# Altium project jetson-tx-camera-adapter.PrjPcb
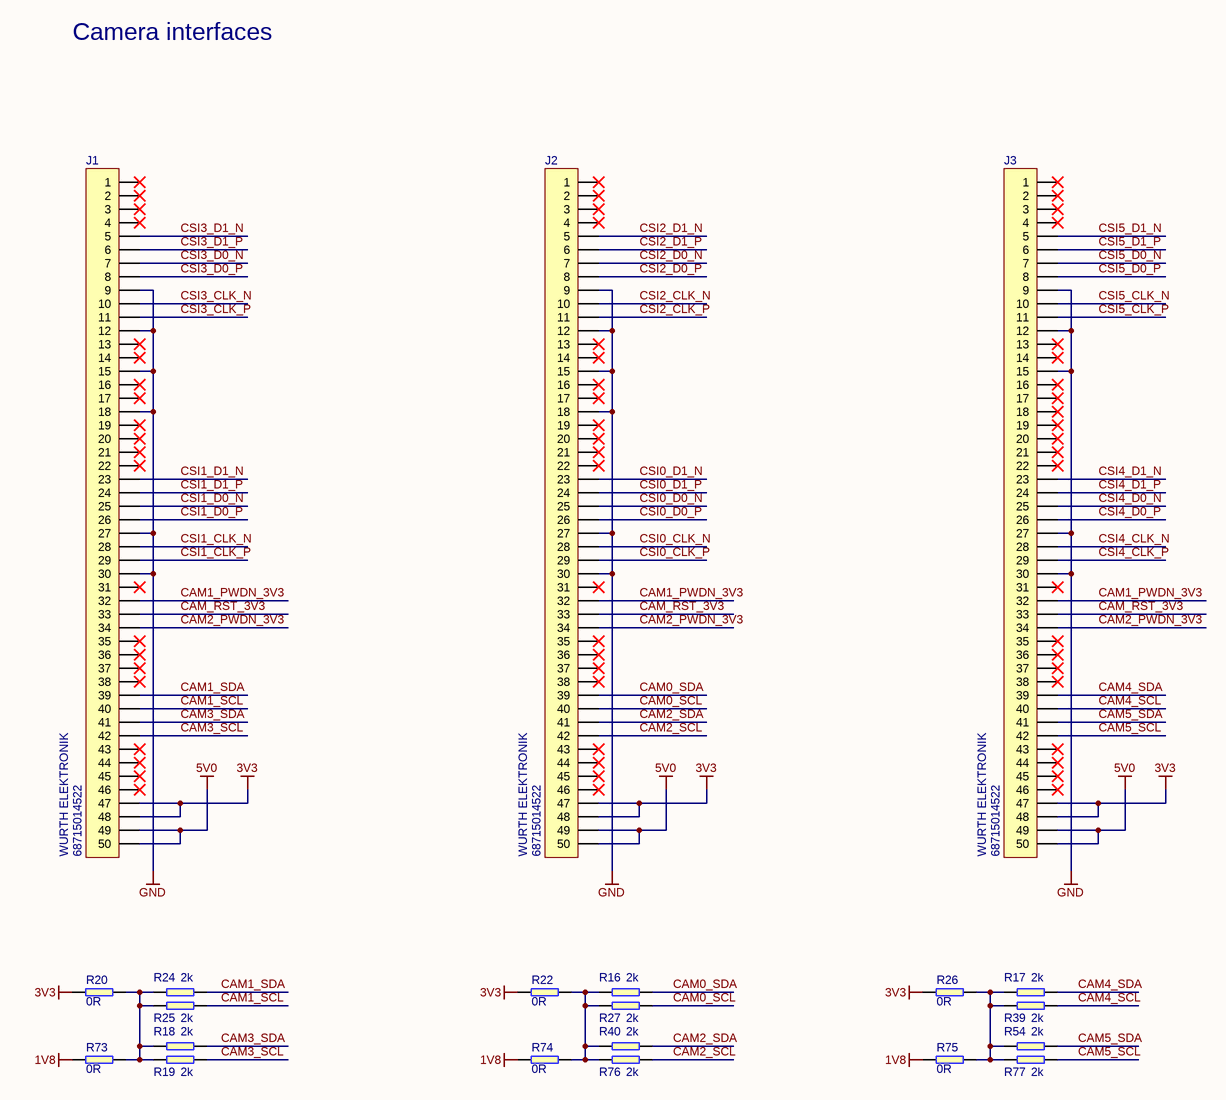
[diagram p0: Cameras.SchDoc]
AM_Title: Jetson TX Camera Adapter; AM_Status: OSHW; AM_Revision: 1.6.1
4 sheets, 113 parts. Net scope: global (net labels, ports and power ports of the same name join across sheets).
Board file: PCB.PcbDoc
Sheets:
  Cameras.SchDoc
  CAN.SchDoc
  ID-Serial.SchDoc
  Interface.SchDoc

## Sheet Cameras.SchDoc: =AM_Title
size A3; CompanyName: Antmicro Ltd; Address1: Zwierzyniecka 3; Address2: 60-813 Poznań; Address3: Poland; Address4: 60-813 Poznań, Poland; Revision: 1.6.1; SheetNumber: 1; SheetTotal: 1; PageSetup: Record=PageOptions|CenterHorizontal=True|CenterVertical=True|PrintScale=0.97|XCorrection=1.00|YCorrection=1.00|PrintKind=1|BorderSize=5000000|LeftOffset=0|BottomOffset=0|Orientation=2|PaperLength=2970|PaperWidth=2100|Scale=100|PaperSource=7|PrintQuality=600|MediaType=1|DitherType=10|PaperKind=A4|PrintScaleMode=1

### Parts
J1  68715014522  Manufacturer: WURTH ELEKTRONIK  [68715014522_FLIPPED]
J2  68715014522  Manufacturer: WURTH ELEKTRONIK  [68715014522_FLIPPED]
J3  68715014522  Manufacturer: WURTH ELEKTRONIK  [68715014522_FLIPPED]
R16  2k  [0603]
R17  2k  [0603]
R18  2k  [0603]
R19  2k  [0603]
R20  0R  [0603]
R22  0R  [0603]
R24  2k  [0603]
R25  2k  [0603]
R26  0R  [0603]
R27  2k  [0603]
R39  2k  [0603]
R40  2k  [0603]
R54  2k  [0603]
R73  0R  [0603]
R74  0R  [0603]
R75  0R  [0603]
R76  2k  [0603]
R77  2k  [0603]

### Nets
1V8: R73.1 R74.1 R75.1
3V3: J1.47 J1.48 J2.47 J2.48 J3.47 J3.48 R20.1 R22.1 R26.1
5V0: J1.49 J1.50 J2.49 J2.50 J3.49 J3.50
GND: J1.9 J1.12 J1.15 J1.18 J1.27 J1.30 J2.9 J2.12 J2.15 J2.18 J2.27 J2.30 J3.9 J3.12 J3.15 J3.27 J3.30
CAM0_SCL: J2.40 R27.1
CAM0_SDA: J2.39 R16.1
CAM1_PWDN_3V3: J1.32 J2.32 J3.32
CAM1_SCL: J1.40 R25.1
CAM1_SDA: J1.39 R24.1
CAM2_PWDN_3V3: J1.34 J2.34 J3.34
CAM2_SCL: J2.42 R76.1
CAM2_SDA: J2.41 R40.1
CAM3_SCL: J1.42 R19.1
CAM3_SDA: J1.41 R18.1
CAM4_SCL: J3.40 R39.1
CAM4_SDA: J3.39 R17.1
CAM5_SCL: J3.42 R77.1
CAM5_SDA: J3.41 R54.1
CAM_RST_3V3: J1.33 J2.33 J3.33
CSI0_CLK_N: J2.28
CSI0_CLK_P: J2.29
CSI0_D0_N: J2.25
CSI0_D0_P: J2.26
CSI0_D1_N: J2.23
CSI0_D1_P: J2.24
CSI1_CLK_N: J1.28
CSI1_CLK_P: J1.29
CSI1_D0_N: J1.25
CSI1_D0_P: J1.26
CSI1_D1_N: J1.23
CSI1_D1_P: J1.24
CSI2_CLK_N: J2.10
CSI2_CLK_P: J2.11
CSI2_D0_N: J2.7
CSI2_D0_P: J2.8
CSI2_D1_N: J2.5
CSI2_D1_P: J2.6
CSI3_CLK_N: J1.10
CSI3_CLK_P: J1.11
CSI3_D0_N: J1.7
CSI3_D0_P: J1.8
CSI3_D1_N: J1.5
CSI3_D1_P: J1.6
CSI4_CLK_N: J3.28
CSI4_CLK_P: J3.29
CSI4_D0_N: J3.25
CSI4_D0_P: J3.26
CSI4_D1_N: J3.23
CSI4_D1_P: J3.24
CSI5_CLK_N: J3.10
CSI5_CLK_P: J3.11
CSI5_D0_N: J3.7
CSI5_D0_P: J3.8
CSI5_D1_N: J3.5
CSI5_D1_P: J3.6
NetR16_2: R16.2 R22.2 R27.2 R40.2 R74.2 R76.2
NetR17_2: R17.2 R26.2 R39.2 R54.2 R75.2 R77.2
NetR18_2: R18.2 R19.2 R20.2 R24.2 R25.2 R73.2

Not connected (* = marked no-connect by the designer): J1 1* 2* 3* 4* 13* 14* 16* 17* 19* 20* 21* 22* 31* 35* 36* 37* 38* 43* 44* 45* 46*; J2 1* 2* 3* 4* 13* 14* 16* 17* 19* 20* 21* 22* 31* 35* 36* 37* 38* 43* 44* 45* 46*; J3 1* 2* 3* 4* 13* 14* 16* 17* 18* 19* 20* 21* 22* 31* 35* 36* 37* 38* 43* 44* 45* 46*

### Notes on the sheet
- Camera interfaces
- Title:
- Drawn by:
- Size:
- Date:
- Approved by:
- A3
- Revision:
- Page:
- of
- www.antmicro.com
- File:

### Library data of the parts
J1-J3 = WE-687-150-145-22_FLIPPED: 0.50mm SMT ZIF Horizontal Bottom Contact WR-FPC; Part Number: WE-687-150-145-22_FLIPPED; Supplier Part Number 1: 1908481; Value: 68715014522; Supplier 1: Farnell; Part Symbol: 68715014522
R16-R19 R24 R25 R27 R39 R40 R54 R76 R77 = R_2k_0603: SMT Resistor 2k 0603; Manufacturer: MULTICOMP; Part Symbol: MCMR06X2001FTL; Value: 2k; Part Number: R_2k_0603; Supplier 1: Farnell; Supplier Part Number 1: 2073418
R20 R22 R26 R73-R75 = R_0R_0603: SMT Resistor 0R 0603; Manufacturer: BOURNS; Part Symbol: CR0603-J/-000ELF; Tolerance: 5%; Part Number: R_0R_0603; Value: 0R; Supplier 1: Farnell; Supplier Part Number 1: 2008343

## Sheet CAN.SchDoc: =AM_Title
size A3; CompanyName: Antmicro Ltd; Address1: Zwierzyniecka 3; Address2: 60-813 Poznań; Address3: Poland; Address4: 60-813 Poznań, Poland; Revision: 1.6.1; SheetNumber: 1; SheetTotal: 1; PageSetup: Record=PageOptions|CenterHorizontal=True|CenterVertical=True|PrintScale=0.97|XCorrection=1.00|YCorrection=1.00|PrintKind=1|BorderSize=5000000|LeftOffset=0|BottomOffset=0|Orientation=2|PaperLength=2970|PaperWidth=2100|Scale=100|PaperSource=7|PrintQuality=600|MediaType=1|DitherType=10|PaperKind=A4|PrintScaleMode=1
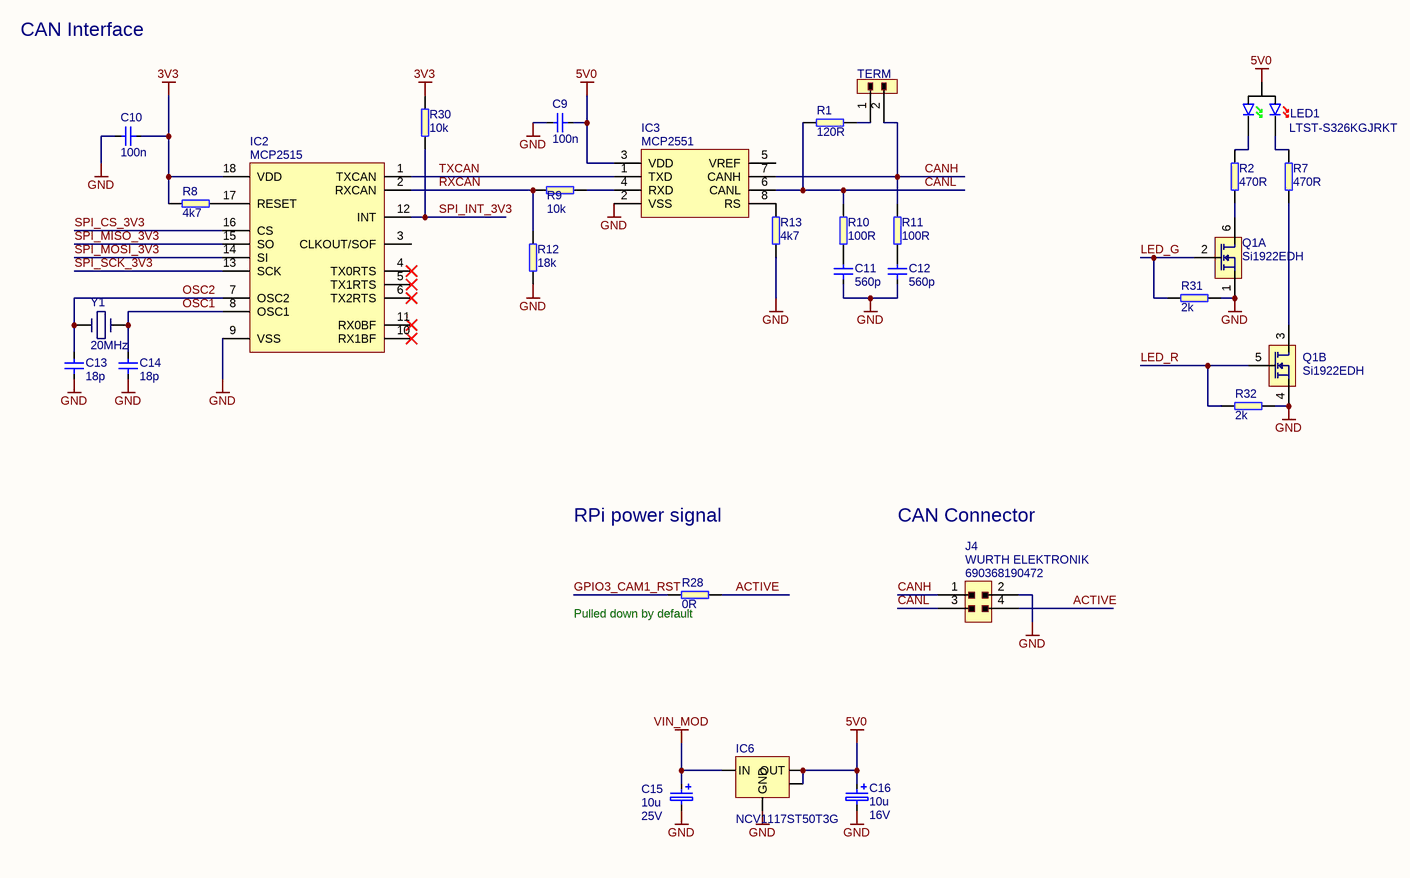
[diagram p1: CAN.SchDoc]

### Parts
C9  100n  [0402]
C10  100n  [0402]
C11  560p  [0603]
C12  560p  [0603]
C13  18p  [0402]
C14  18p  [0402]
C15  value 10u  Voltage: 25V  [KEMET_C]  (hidden comment: CPol)
C16  Voltage: 16V  [KEMET_A]  (hidden comment: 10u)
IC2  MCP2515  [SOIC-18]
IC3  MCP2551  [SOIC-8]
IC6  value NCV1117ST50T3G  [SOT223]  (hidden comment: xx1117)
J4  Manufacturer: WURTH ELEKTRONIK  Part Symbol: 690368190472  [WE_690368190472]  (hidden comment: WE_690368190472)
LED1  Part Symbol: LTST-S326KGJRKT  [LED-LiteON-LTST-S326KGJRKT]  (hidden comment: LED-LiteON-LTST-S326KGJRKT)
Q1  Si1922EDH  [SOT-363]  (parts A,B of 2)
R1  120R  [0603]
R2  470R  [0603]
R7  470R  [0603]
R8  4k7  [0603]
R9  10k  [0603]
R10  100R  [0603]
R11  100R  [0603]
R12  18k  [0603]
R13  4k7  [0603]
R28  0R  [0603]
R30  10k  [0603]
R31  2k  [0603]
R32  2k  [0603]
TERM  HEADER_1X2_male  [HEADER_1X2_male 2.54mm]  (value not drawn)
Y1  20MHz  [TXC_7A]

### Nets
3V3: C10.1 IC2.18(VDD) R8.2 R30.2
5V0: C9.1 C16.1 IC3.3(VDD) IC6.2(OUT) IC6.4(OUT) LED1.A
GND: C9.2 C10.2 C11.1 C12.1 C13.1 C14.1 C15.2 C16.2 IC2.9(VSS) IC3.2(VSS) IC6.1(GND) J4.2 Q1.1(S1) Q1.4(S2) R12.1 R13.1 R31.2 R32.2
VIN_MOD: C15.1 IC6.3(IN)
ACTIVE: J4.4 R28.2
CANH: IC3.7(CANH) J4.1 R11.2 TERM.2
CANL: IC3.6(CANL) J4.3 R1.1 R10.2
GPIO3_CAM1_RST: R28.1
LED_G: Q1.2(G1) R31.1
LED_R: Q1.5(G2) R32.1
OSC1: C14.2 IC2.8(OSC1) Y1.1
OSC2: C13.2 IC2.7(OSC2) Y1.2
RXCAN: IC2.2(RXCAN) R9.1 R12.2
SPI_CS_3V3: IC2.16(CS)
SPI_INT_3V3: IC2.12(INT) R30.1
SPI_MISO_3V3: IC2.15(SO)
SPI_MOSI_3V3: IC2.14(SI)
SPI_SCK_3V3: IC2.13(SCK)
TXCAN: IC2.1(TXCAN) IC3.1(TXD)
NetC11_2: C11.2 R10.1
NetC12_2: C12.2 R11.1
NetIC2_17: IC2.17(RESET) R8.1
NetIC3_4: IC3.4(RXD) R9.2
NetIC3_8: IC3.8(RS) R13.2
NetLED1_C1: LED1.C1 R7.2
NetLED1_C2: LED1.C2 R2.2
NetQ1_3: Q1.3(D2) R7.1
NetQ1_6: Q1.6(D1) R2.1
NetR1_2: R1.2 TERM.1

Not connected (* = marked no-connect by the designer): IC2 3(CLKOUT/SOF) 4(TX0RTS)* 5(TX1RTS)* 6(TX2RTS)* 10(RX1BF)* 11(RX0BF)*; IC3 5(VREF)

### Notes on the sheet
- CAN Interface
- RPi power signal
- CAN Connector
- (near R28) Pulled down by default
- Title:
- Drawn by:
- Size:
- Date:
- Approved by:
- A3
- Revision:
- Page:
- of
- www.antmicro.com
- File:

### Library data of the parts
C9 C10 = C_100n_0402: MLCC SMT Capacitor 100nF 0402; Manufacturer: MULTICOMP; Part Symbol: MC0402X104M100CT; Value: 100n; Part Number: C_100n_0402; Supplier 1: Farnell; Supplier Part Number 1: 2309011
C11 C12 = C_560p_0603: MLCC SMT Capacitor 560pF 0603; Manufacturer: MULTICOMP; Part Symbol: MC0603N561J500CT; Value: 560p; Part Number: C_560p_0603; Supplier 1: Farnell; Supplier Part Number 1: 1759082
C13 C14 = C_18p_0402: MLCC SMT Capacitor 18pF 0603; Manufacturer: KEMET; Part Symbol: C0402C180J5GACAUTO; Value: 18p; Part Number: C_18p_0402; Supplier 1: Farnell; Supplier Part Number 1: 2070379
C15 = C_10u_KEMET_C: Tantalum SMT Capacitor 10uF Case KEMET_C; Manufacturer: KEMET; Part Symbol: T491C106K025AT; Part Number: C_10u_KEMET_C; Supplier 1: Farnell; Supplier Part Number 1: 1457463
C16 = C_10u_KEMET_A: Tantalum SMT Capacitor 10uF Case KEMET_A; Manufacturer: VISHAY; Part Symbol: 293D106X9016A2TE3; Value: 10u; Part Number: C_10u_KEMET_A; Supplier 1: Farnell; Supplier Part Number 1: 1754182
IC2 = MCP2515-I/SO: CAN CONTROLLER, SPI, 1MBPS; Manufacturer: MICROCHIP; Supplier 1: Farnell; Supplier Part Number 1: 1292239; Part Number: MCP2515-I/SO; Value: MCP2515; Part Symbol: MCP2515-I/SO
IC3 = MCP2551-I/SN: MCP2551-I/SN  IC, CAN TRANSCEIVER, HI SPEED, SMD; Manufacturer: MICROCHIP; Supplier 1: Farnell; Supplier Part Number 1: 9758569; Part Number: MCP2551-I/SN; Value: MCP2551; Part Symbol: MCP2551-I/SN
IC6 = xx1117: ON SEMICONDUCTOR  NCV1117ST50T3G  Fixed LDO Voltage Regulator, 20V in, 1.07V Dropout, 5V/1A out, SOT-223-3; Part Number: NCV1117ST50T3G; Supplier 1: Farnell; Supplier Part Number 1: 2534280; Manufacturer: ON SEMICONDUCTOR; Part Symbol: NCV1117ST50T3G
LED1 = LED-LiteON-LTST-S326KGJRKT: Standard LEDs - SMD Green/Red Clear 571nm/631nm; Manufacturer: Lite-On; Part Number: LED-LiteON-LTST-S326KGJRKT; Value: LED-LiteON-LTST-S326KGJRKT; Supplier 1: Mouser; Supplier Part Number 1: 859-LTST-S326KGJRKT
Q1 = Si1922EDH: 20 V, dual N-channel Trench MOSFET; Manufacturer: Vishay; Part Number: Si1922EDH; Value: Si1922EDH; Supplier 1: Farnell; Supplier Part Number 1: 2056714; Part Symbol: Si1922EDH
R1 = R_120R_0603: SMT Resistor 120R 0603; Manufacturer: VISHAY; Part Symbol: CRCW0603120RFKEA; Tolerance: 1%; Value: 120R; Part Number: R_120R_0603; Supplier 1: Farnell; Supplier Part Number 1: 1652832
R2 R7 = R_470R_0603: SMT Resistor 470R 0603; Manufacturer: BOURNS; Part Symbol: CR0603-JW-471GLF; Value: 470R; Part Number: R_470R_0603; Supplier 1: Farnell; Supplier Part Number 1: 2008354
R8 R13 = R_4k7_0603: SMT Resistor 4k7 0603; Manufacturer: BOURNS; Part Symbol: CR0603-FX-4701ELF; Value: 4k7; Part Number: R_4k7_0603; Supplier 1: Farnell; Supplier Part Number 1: 2008340
R9 R30 = R_10k_0603: SMT Resistor 10k 0603; Manufacturer: BOURNS; Part Symbol: CR0603-JW-103ELF; Value: 10k; Part Number: R_10k_0603; Supplier 1: Farnell; Supplier Part Number 1: 2008360
R10 R11 = R_100R_0603: SMT Resistor 100R 0603; Manufacturer: MULTICOMP; Part Symbol: MC0063W06035100R; Tolerance: 5%; Value: 100R; Part Number: R_100R_0603; Supplier 1: Farnell; Supplier Part Number 1: 9331689
R12 = R_18k_0603: SMT Resistor 18k 0603; Manufacturer: MULTICOMP; Part Symbol: MC0063W0603118K; Tolerance: 1%; Value: 18k; Part Number: R_18k_0603; Supplier 1: Farnell; Supplier Part Number 1: 9330720
R28 = R_0R_0603: as R20 on sheet Cameras; Part Number: R_0R_0603; Value: 0R; Supplier 1: Farnell; Supplier Part Number 1: 2008343
R31 R32 = R_2k_0603: as R16 on sheet Cameras; Value: 2k; Part Number: R_2k_0603; Supplier 1: Farnell; Supplier Part Number 1: 2073418
TERM = HEADER_1X2_male: 1x2 pinhead male; Part Number: HEADER_1X2_male
Y1 = CRYSTAL_20MHz_SMD_TXC: CRYSTAL, 20.000MHZ; Manufacturer: TXC; Part Symbol: 7A-20.000MAAJ-T; Value: 20MHz; Part Number: CRYSTAL_20MHz_SMD_TXC; Supplier 1: Farnell; Supplier Part Number 1: 1841950
J4 = WE_690368190472: Part Number: WE_690368190472; Value: WE_690368190472

## Sheet ID-Serial.SchDoc: =AM_Title
size A3; CompanyName: Antmicro Ltd; Address1: Zwierzyniecka 3; Address2: 60-813 Poznań; Address3: Poland; Address4: 60-813 Poznań, Poland; Revision: 1.6.1; SheetNumber: 1; SheetTotal: 1; PageSetup: Record=PageOptions|CenterHorizontal=True|CenterVertical=True|PrintScale=0.97|XCorrection=1.00|YCorrection=1.00|PrintKind=1|BorderSize=5000000|LeftOffset=0|BottomOffset=0|Orientation=2|PaperLength=2970|PaperWidth=2100|Scale=100|PaperSource=7|PrintQuality=600|MediaType=1|DitherType=10|PaperKind=A4|PrintScaleMode=1
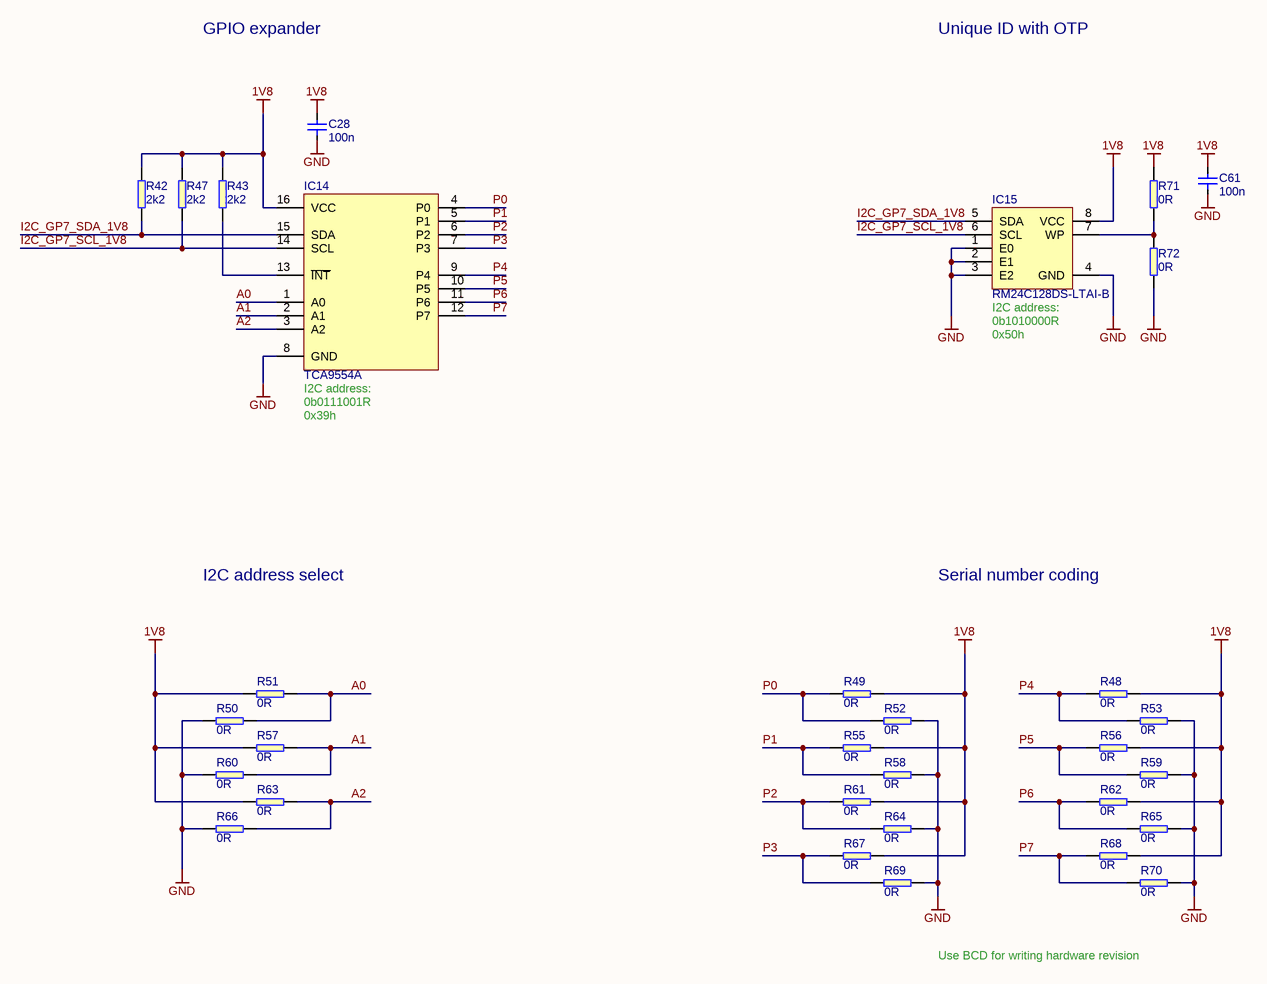
[diagram p2: ID-Serial.SchDoc]

### Parts
C28  100n  [0603]
C61  100n  [0603]
IC14  TCA9554A  [DBQ0016A]
IC15  RM24C128DS-LTAI-B  [TSSOP-8]
R42  2k2  [0603]
R43  2k2  [0603]
R47  2k2  [0603]
R48  0R  [0402]
R49  0R  [0402]
R50  0R  [0402]
R51  0R  [0402]
R52  0R  [0402]
R53  0R  [0402]
R55  0R  [0402]
R56  0R  [0402]
R57  0R  [0402]
R58  0R  [0402]
R59  0R  [0402]
R60  0R  [0402]
R61  0R  [0402]
R62  0R  [0402]
R63  0R  [0402]
R64  0R  [0402]
R65  0R  [0402]
R66  0R  [0402]
R67  0R  [0402]
R68  0R  [0402]
R69  0R  [0402]
R70  0R  [0402]
R71  0R  [0603]
R72  0R  [0603]

### Nets
1V8: C28.2 C61.2 IC14.16(VCC) IC15.8(VCC) R42.2 R43.2 R47.2 R48.2 R49.2 R51.1 R55.2 R56.2 R57.1 R61.2 R62.2 R63.1 R67.2 R68.2 R71.2
GND: C28.1 C61.1 IC14.8(GND) IC15.1(E0) IC15.2(E1) IC15.3(E2) IC15.4(GND) R50.1 R52.2 R53.2 R58.2 R59.2 R60.1 R64.2 R65.2 R66.1 R69.2 R70.2 R72.1
A0: IC14.1(A0) R50.2 R51.2
A1: IC14.2(A1) R57.2 R60.2
A2: IC14.3(A2) R63.2 R66.2
I2C_GP7_SCL_1V8: IC14.14(SCL) IC15.6(SCL) R47.1
I2C_GP7_SDA_1V8: IC14.15(SDA) IC15.5(SDA) R42.1
P0: IC14.4(P0) R49.1 R52.1
P1: IC14.5(P1) R55.1 R58.1
P2: IC14.6(P2) R61.1 R64.1
P3: IC14.7(P3) R67.1 R69.1
P4: IC14.9(P4) R48.1 R53.1
P5: IC14.10(P5) R56.1 R59.1
P6: IC14.11(P6) R62.1 R65.1
P7: IC14.12(P7) R68.1 R70.1
NetIC14_13: IC14.13(~{INT}) R43.1
NetIC15_7: IC15.7(WP) R71.1 R72.2

### Notes on the sheet
- GPIO expander
- Unique ID with OTP
- (near IC15) 0b1010000R
- 0x50h
- (near IC15) I2C address:
- (near IC14) 0b0111001R
- 0x39h
- (near IC14) I2C address:
- I2C address select
- Serial number coding
- Use BCD for writing hardware revision
- Title:
- Drawn by:
- Size:
- Date:
- Approved by:
- A3
- Revision:
- Page:
- of
- www.antmicro.com
- File:

### Library data of the parts
C28 C61 = C_100n_0603: MLCC SMT Capacitor 100nF 0603; Manufacturer: WALSIN; Part Symbol: 0603B104K500CT; Part Number: C_100n_0603; Value: 100n; Supplier 1: Farnell; Supplier Part Number 1: 2496834
IC14 = TCA9554A: Remote 8bit I2C SMBus I/O expander; Manufacturer: Texas Instruments; Part Number: TCA9554A; Value: TCA9554A; Supplier 1: Farnell; Supplier Part Number 1: 2496570; Part Symbol: TCA9554A
IC15 = RM24C128DS: EEPROM with UID and OTP registers.; Manufacturer: Adesto; Part Number: RM24C128DS; Value: RM24C128DS-LTAI-B; Supplier 1: Digi-Key; Supplier Part Number 1: 1265-1249-ND; Part Symbol: RM24C128DS-LTAI-B
R42 R43 R47 = R_2k2_0603: SMT Resistor 2k2 0603; Manufacturer: MULTICOMP; Part Symbol: MCMR06X2201FTL; Part Number: R_2k2_0603; Value: 2k2; Supplier 1: Farnell; Supplier Part Number 1: 2073429
R48-R53 R55-R70 = R_0R_0402: SMT Resistor 0402; Manufacturer: MULTICOMP; Part Symbol: MCMR04X000 PTL; Part Number: R_0R_0402; Value: 0R; Supplier 1: Farnell; Supplier Part Number 1: 2072513
R71 R72 = R_0R_0603: as R20 on sheet Cameras; Part Number: R_0R_0603; Value: 0R; Supplier 1: Farnell; Supplier Part Number 1: 2008343

## Sheet Interface.SchDoc: =AM_Title
size A3; CompanyName: Antmicro Ltd; Address1: Zwierzyniecka 3; Address2: 60-813 Poznań; Address3: Poland; Address4: 60-813 Poznań, Poland; Revision: 1.6.1; SheetNumber: 1; SheetTotal: 1; PageSetup: Record=PageOptions|CenterHorizontal=True|CenterVertical=True|PrintScale=0.97|XCorrection=1.00|YCorrection=1.00|PrintKind=1|BorderSize=5000000|LeftOffset=0|BottomOffset=0|Orientation=2|PaperLength=2970|PaperWidth=2100|Scale=100|PaperSource=7|PrintQuality=600|MediaType=1|DitherType=10|PaperKind=A4|PrintScaleMode=1
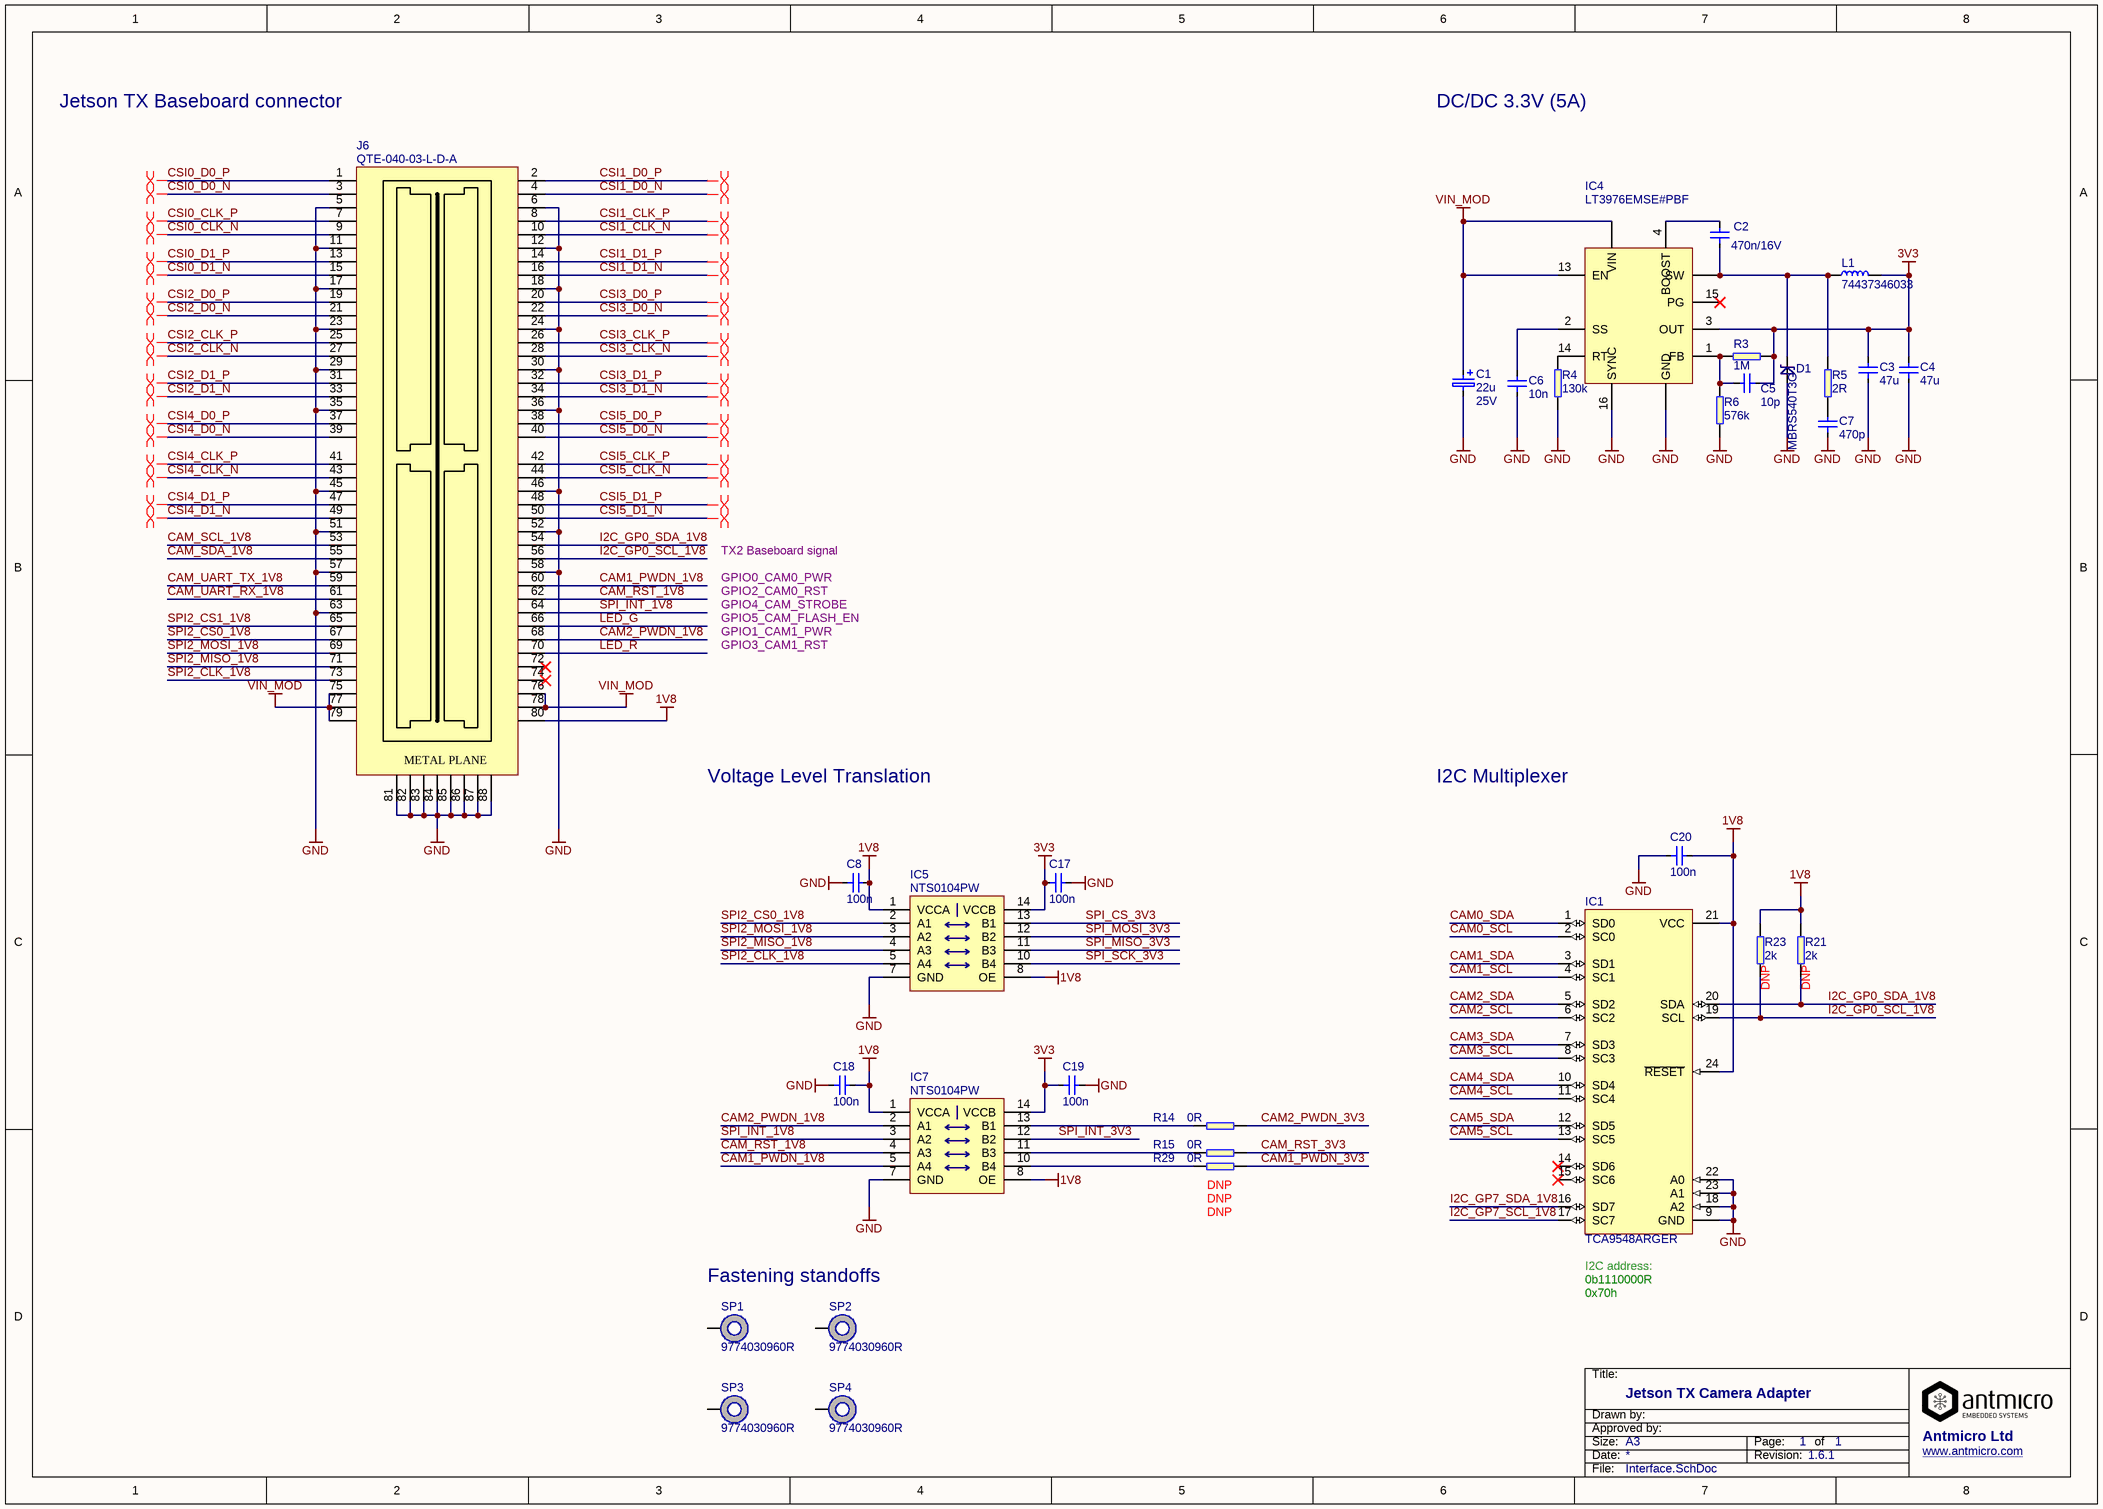
[diagram p3: Interface.SchDoc]

### Parts
C1  Voltage: 25V  [KEMET_C]  (hidden comment: 22u)
C2  470n/16V  [0402]
C3  47u  [1206]
C4  47u  [1206]
C5  10p  [0402]
C6  10n  [0402]
C7  470p  [0402]
C8  100n  [0402]
C17  100n  [0402]
C18  100n  [0402]
C19  100n  [0402]
C20  100n  [0402]
D1  MBRS540T3G  [SMC-403-03]
IC1  TCA9548ARGER  [VQFN-24]
IC4  LT3976EMSE#PBF  [LT3976EMSE]
IC5  NTS0104PW  [TSSOP-14]
IC7  NTS0104PW  [TSSOP-14]
J6  QTE-040-03-L-D-A  [QTE-040-03-L-D-A]
L1  74437346033  [WE-LHMI]
R3  1M  [0603]
R4  130k  [0402]
R5  2R  [0402]
R6  576k  [0402]
R14  0R  [0402]
R15  0R  [0402]
R21  2k  [0603]
R23  2k  [0603]
R29  0R  [0402]
SP1  9774030960R  [9774030960]
SP2  9774030960R  [9774030960]
SP3  9774030960R  [9774030960]
SP4  9774030960R  [9774030960]

### Nets
1V8: C8.2 C18.2 C20.2 IC1.21(VCC) IC1.24(~{RESET}) IC5.1(VCCA) IC5.8(OE) IC7.1(VCCA) IC7.8(OE) J6.80 R21.1 R23.1
3V3: C3.2 C4.2 C5.1 C17.1 C19.1 IC4.3(OUT) IC5.14(VCCB) IC7.14(VCCB) L1.2 R3.1
GND: C1.2 C3.1 C4.1 C6.1 C7.1 C8.1 C17.2 C18.1 C19.2 C20.1 D1.A IC1.9(GND) IC1.18(A2) IC1.22(A0) IC1.23(A1) IC4.16(SYNC) IC4.GND IC5.7(GND) IC7.7(GND) J6.5 J6.6 J6.11 J6.12 J6.17 J6.18 J6.23 J6.24 J6.29 J6.30 J6.35 J6.36 J6.45 J6.46 J6.51 J6.52 J6.57 J6.58 J6.63 J6.81 J6.82 J6.83 J6.84 J6.85 J6.86 J6.87 J6.88 R4.1 R6.1
VIN_MOD: C1.1 IC4.13(EN) IC4.VIN J6.75 J6.76 J6.77 J6.78 J6.79
CAM0_SCL: IC1.2(SC0)
CAM0_SDA: IC1.1(SD0)
CAM1_PWDN_1V8: IC7.5(A4) J6.60
CAM1_PWDN_3V3: R29.2
CAM1_SCL: IC1.4(SC1)
CAM1_SDA: IC1.3(SD1)
CAM2_PWDN_1V8: IC7.2(A1) J6.68
CAM2_PWDN_3V3: R14.2
CAM2_SCL: IC1.6(SC2)
CAM2_SDA: IC1.5(SD2)
CAM3_SCL: IC1.8(SC3)
CAM3_SDA: IC1.7(SD3)
CAM4_SCL: IC1.11(SC4)
CAM4_SDA: IC1.10(SD4)
CAM5_SCL: IC1.13(SC5)
CAM5_SDA: IC1.12(SD5)
CAM_RST_1V8: IC7.4(A3) J6.62
CAM_RST_3V3: R15.2
CAM_SCL_1V8: J6.53
CAM_SDA_1V8: J6.55
CAM_UART_RX_1V8: J6.61
CAM_UART_TX_1V8: J6.59
CSI0_CLK_N: J6.9
CSI0_CLK_P: J6.7
CSI0_D0_N: J6.3
CSI0_D0_P: J6.1
CSI0_D1_N: J6.15
CSI0_D1_P: J6.13
CSI1_CLK_N: J6.10
CSI1_CLK_P: J6.8
CSI1_D0_N: J6.4
CSI1_D0_P: J6.2
CSI1_D1_N: J6.16
CSI1_D1_P: J6.14
CSI2_CLK_N: J6.27
CSI2_CLK_P: J6.25
CSI2_D0_N: J6.21
CSI2_D0_P: J6.19
CSI2_D1_N: J6.33
CSI2_D1_P: J6.31
CSI3_CLK_N: J6.28
CSI3_CLK_P: J6.26
CSI3_D0_N: J6.22
CSI3_D0_P: J6.20
CSI3_D1_N: J6.34
CSI3_D1_P: J6.32
CSI4_CLK_N: J6.43
CSI4_CLK_P: J6.41
CSI4_D0_N: J6.39
CSI4_D0_P: J6.37
CSI4_D1_N: J6.49
CSI4_D1_P: J6.47
CSI5_CLK_N: J6.44
CSI5_CLK_P: J6.42
CSI5_D0_N: J6.40
CSI5_D0_P: J6.38
CSI5_D1_N: J6.50
CSI5_D1_P: J6.48
I2C_GP0_SCL_1V8: IC1.19(SCL) J6.56 R23.2
I2C_GP0_SDA_1V8: IC1.20(SDA) J6.54 R21.2
I2C_GP7_SCL_1V8: IC1.17(SC7)
I2C_GP7_SDA_1V8: IC1.16(SD7)
LED_G: J6.66
LED_R: J6.70
SPI2_CLK_1V8: IC5.5(A4) J6.73
SPI2_CS0_1V8: IC5.2(A1) J6.67
SPI2_CS1_1V8: J6.65
SPI2_MISO_1V8: IC5.4(A3) J6.71
SPI2_MOSI_1V8: IC5.3(A2) J6.69
SPI_CS_3V3: IC5.13(B1)
SPI_INT_1V8: IC7.3(A2) J6.64
SPI_INT_3V3: IC7.12(B2)
SPI_MISO_3V3: IC5.11(B3)
SPI_MOSI_3V3: IC5.12(B2)
SPI_SCK_3V3: IC5.10(B4)
NetC2_1: C2.1 D1.C IC4.SW L1.1 R5.2
NetC2_2: C2.2 IC4.4(BOOST)
NetC5_2: C5.2 IC4.1(FB) R3.2 R6.2
NetC6_2: C6.2 IC4.2(SS)
NetC7_2: C7.2 R5.1
NetIC4_14: IC4.14(RT) R4.2
NetIC7_10: IC7.10(B4) R29.1
NetIC7_11: IC7.11(B3) R15.1
NetIC7_13: IC7.13(B1) R14.1

Not connected (* = marked no-connect by the designer): IC1 14(SD6)* 15(SC6)*; IC4 15(PG)*; J6 72* 74*; SP1 1; SP2 1; SP3 1; SP4 1

### Layout directives
differential pair: CSI0_CLK_N, CSI0_CLK_P, CSI0_D0_N, CSI0_D0_P, CSI0_D1_N, CSI0_D1_P, CSI1_CLK_N, CSI1_CLK_P, CSI1_D0_N, CSI1_D0_P, CSI1_D1_N, CSI1_D1_P, CSI2_CLK_N, CSI2_CLK_P, CSI2_D0_N, CSI2_D0_P, CSI2_D1_N, CSI2_D1_P, CSI3_CLK_N, CSI3_CLK_P, CSI3_D0_N, CSI3_D0_P, CSI3_D1_N, CSI3_D1_P, CSI4_CLK_N, CSI4_CLK_P, CSI4_D0_N, CSI4_D0_P, CSI4_D1_N, CSI4_D1_P, CSI5_CLK_N, CSI5_CLK_P, CSI5_D0_N, CSI5_D0_P, CSI5_D1_N, CSI5_D1_P

### Notes on the sheet
- Jetson TX Baseboard connector
- DC/DC 3.3V (5A)
- GPIO0_CAM0_PWR
- TX2 Baseboard signal
- GPIO2_CAM0_RST
- GPIO4_CAM_STROBE
- GPIO5_CAM_FLASH_EN
- GPIO1_CAM1_PWR
- GPIO3_CAM1_RST
- Voltage Level Translation
- I2C Multiplexer
- (near R23) DNP
- (near R21) DNP
- (near R29) DNP
- DNP
- Fastening standoffs
- 0x70h
- 0b1110000R
- (near IC1) I2C address:
- Title:
- Drawn by:
- Size:
- Date:
- Approved by:
- A3
- Revision:
- Page:
- of
- www.antmicro.com
- File:
- (in symbol QTE-040-03-L-D-A) METAL PLANE

### Library data of the parts
C1 = C_22u_KEMET_C: Tantalum SMT Capacitor 22uF Case KEMET_C; Manufacturer: KEMET; Part Symbol: T491C226K025AT; Value: 22u; Part Number: C_22u_KEMET_C; Supplier 1: Farnell; Supplier Part Number 1: 2283579
C2 = C_470n_0402_16V: MLCC SMT Capacitor 470nF 0402 16V; Manufacturer: TDK; Part Symbol: C1005X5R1C474K050BC; Value: 470n/16V; Part Number: C_470n_0402_16V; Supplier 1: Farnell; Supplier Part Number 1: 2346883
C3 C4 = C_47u_1206: MLCC SMT Capacitor 47uF 1206; Manufacturer: MURATA; Part Symbol: GRM31CC80J476KE18L; Value: 47u; Part Number: C_47u_1206; Supplier 1: Farnell; Supplier Part Number 1: 2218907
C5 = C_10p_0402: MLCC SMT Capacitor 10pF 0402; Manufacturer: MULTICOMP; Part Symbol: MC0402N100D500CT; Value: 10p; Part Number: C_10p_0402; Supplier 1: Farnell; Supplier Part Number 1: 1758941
C6 = C_10n_0402: MLCC SMT Capacitor 10nF 0402; Manufacturer: AVX; Part Symbol: 04025G103ZAT2A; Value: 10n; Part Number: C_10n_0402; Supplier 1: Farnell; Supplier Part Number 1: 2332531
C7 = C_470p_0402: MLCC SMT Capacitor 470pF 0402; Manufacturer: MULTICOMP; Part Symbol: MC0402B471J500CT; Value: 470p; Part Number: C_470p_0402; Supplier 1: Farnell; Supplier Part Number 1: 2320771
C8 C17-C20 = C_100n_0402: as C9 on sheet CAN; Part Number: C_100n_0402; Value: 100n; Supplier 1: Farnell; Supplier Part Number 1: 2309011
D1 = MBRS540T3G: ON SEMICONDUCTOR  MBRS540T3G  Rectifier Diode, Single, 40 V, 5 A, 500 mV, 190 A; Part Number: MBRS540T3G; Value: MBRS540T3G; Supplier 1: Farnell; Supplier Part Number 1: 2101838; Manufacturer: ON SEMICONDUCTOR; Part Symbol: MBRS540T3G
IC1 = TCA9548ARGER: TCA9548ARGER  I2C SWITCH W/ RESET, 8-CH, VQFN-24; Manufacturer: TEXAS INSTRUMENTS; Part Number: TCA9548ARGER; Value: TCA9548ARGER; Supplier 1: Farnell; Supplier Part Number 1: 2496588; Part Symbol: TCA9548ARGER
IC4 = LT3976EMSE#PBF: LINEAR TECHNOLOGY  LT3976EMSE#PBF  DC-DC CONVERTER, 2MHZ, 5A, MSOP-16; Part Number: LT3976EMSE#PBF; Value: LT3976EMSE#PBF; Supplier 1: Farnell; Supplier Part Number 1: 2215131; Manufacturer: LINEAR TECHNOLOGY; Part Symbol: LT3976EMSE#PBF; ClassName: 12V0 Converter
IC5 IC7 = NTS0104PW: 4 bit voltage level translator; Manufacturer: NXP; Part Number: NTS0104PW; Value: NTS0104PW; Supplier 1: Farnell; Supplier Part Number 1: 2164815; Part Symbol: NTS0104PW
J6 = QTE-040-03-L-D-A: SAMTEC  QTE-040-03-L-D-A  Stacking Board Connector, Dual Row, QTE Series, 80 Contacts, Header, 0.8 mm, Surface Mount; Part Number: QTE-040-03-L-D-A; Supplier Part Number 1: 1667888; Value: QTE-040-03-L-D-A; Supplier 1: Farnell; Manufacturer: SAMTEC; Part Symbol: QTE-040-03-L-D-A
L1 = Wurth-74437346033: 3.3 uH, 5.0A, 0.03 ohm, SMD Power Inductor; Manufacturer: WURTH ELEKTRONIK; Part Number: Wurth-74437346033; Value: 74437346033; Supplier 1: Farnell; Supplier Part Number 1: 2077789; Part Symbol: 74437346033
R3 = R_1M_0603_0.1%: SMT Resistor 1M 0603 0.1%; Manufacturer: TE; Part Symbol: CPF0603B1M0E; Value: 1M; Part Number: R_1M_0603_0.1%; Tolerance: 0.1%; Supplier 1: Mouser; Supplier Part Number 1: 279-CPF0603B1M0E
R4 = R_130k_0402: SMT Resistor 2R 0402; Manufacturer: MULTICOMP; Part Symbol: MCMR04X1303FTL; Tolerance: 1%; Value: 130k; Part Number: R_130k_0402; Supplier 1: Farnell; Supplier Part Number 1: 2072607
R5 = R_2R_0402: SMT Resistor 2R 0402; Manufacturer: MULTICOMP; Part Symbol: MC00625W040212R0; Tolerance: 1%; Value: 2R; Part Number: R_2R_0402; Supplier 1: Farnell; Supplier Part Number 1: 2141424
R6 = R_576k_0805_0.1%: SMT Resistor 576k 0805 0.1%; Manufacturer: PANASONIC ELECTRONIC COMPONENTS; Part Symbol: ERA-6AEB5763V; Value: 576k; Part Number: R_576k_0805_0.1%; Tolerance: 0.1%; Supplier 1: Mouser; Supplier Part Number 1: 667-ERA-6AEB5763V
R14 R15 R29 = R_0R_0402: as R48 on sheet ID-Serial; Part Number: R_0R_0402; Value: 0R; Supplier 1: Farnell; Supplier Part Number 1: 2072513
R21 R23 = R_2k_0603: as R16 on sheet Cameras; Value: 2k; Part Number: R_2k_0603; Supplier 1: Farnell; Supplier Part Number 1: 2073418
SP1-SP4 = 9774030960: ROUND SPACER STEEL 3MM unthreaded; Manufacturer: WURTH ELEKTRONIK; Value: 9774030960R; Part Symbol: 9774030960

## Nets that join several sheets
1V8: Cameras (R73.1 R74.1 R75.1), ID-Serial (19 pins), Interface (12 pins)
3V3: Cameras (9 pins), CAN (C10.1 IC2.18 R8.2 R30.2), Interface (10 pins)
5V0: Cameras (6 pins), CAN (6 pins)
GND: Cameras (17 pins), CAN (18 pins), ID-Serial (19 pins), Interface (48 pins)
VIN_MOD: CAN (C15.1 IC6.3), Interface (8 pins)
CAM0_SCL: Cameras (J2.40 R27.1), Interface (IC1.2)
CAM0_SDA: Cameras (J2.39 R16.1), Interface (IC1.1)
CAM1_PWDN_3V3: Cameras (J1.32 J2.32 J3.32), Interface (R29.2)
CAM1_SCL: Cameras (J1.40 R25.1), Interface (IC1.4)
CAM1_SDA: Cameras (J1.39 R24.1), Interface (IC1.3)
CAM2_PWDN_3V3: Cameras (J1.34 J2.34 J3.34), Interface (R14.2)
CAM2_SCL: Cameras (J2.42 R76.1), Interface (IC1.6)
CAM2_SDA: Cameras (J2.41 R40.1), Interface (IC1.5)
CAM3_SCL: Cameras (J1.42 R19.1), Interface (IC1.8)
CAM3_SDA: Cameras (J1.41 R18.1), Interface (IC1.7)
CAM4_SCL: Cameras (J3.40 R39.1), Interface (IC1.11)
CAM4_SDA: Cameras (J3.39 R17.1), Interface (IC1.10)
CAM5_SCL: Cameras (J3.42 R77.1), Interface (IC1.13)
CAM5_SDA: Cameras (J3.41 R54.1), Interface (IC1.12)
CAM_RST_3V3: Cameras (J1.33 J2.33 J3.33), Interface (R15.2)
CSI0_CLK_N: Cameras (J2.28), Interface (J6.9)
CSI0_CLK_P: Cameras (J2.29), Interface (J6.7)
CSI0_D0_N: Cameras (J2.25), Interface (J6.3)
CSI0_D0_P: Cameras (J2.26), Interface (J6.1)
CSI0_D1_N: Cameras (J2.23), Interface (J6.15)
CSI0_D1_P: Cameras (J2.24), Interface (J6.13)
CSI1_CLK_N: Cameras (J1.28), Interface (J6.10)
CSI1_CLK_P: Cameras (J1.29), Interface (J6.8)
CSI1_D0_N: Cameras (J1.25), Interface (J6.4)
CSI1_D0_P: Cameras (J1.26), Interface (J6.2)
CSI1_D1_N: Cameras (J1.23), Interface (J6.16)
CSI1_D1_P: Cameras (J1.24), Interface (J6.14)
CSI2_CLK_N: Cameras (J2.10), Interface (J6.27)
CSI2_CLK_P: Cameras (J2.11), Interface (J6.25)
CSI2_D0_N: Cameras (J2.7), Interface (J6.21)
CSI2_D0_P: Cameras (J2.8), Interface (J6.19)
CSI2_D1_N: Cameras (J2.5), Interface (J6.33)
CSI2_D1_P: Cameras (J2.6), Interface (J6.31)
CSI3_CLK_N: Cameras (J1.10), Interface (J6.28)
CSI3_CLK_P: Cameras (J1.11), Interface (J6.26)
CSI3_D0_N: Cameras (J1.7), Interface (J6.22)
CSI3_D0_P: Cameras (J1.8), Interface (J6.20)
CSI3_D1_N: Cameras (J1.5), Interface (J6.34)
CSI3_D1_P: Cameras (J1.6), Interface (J6.32)
CSI4_CLK_N: Cameras (J3.28), Interface (J6.43)
CSI4_CLK_P: Cameras (J3.29), Interface (J6.41)
CSI4_D0_N: Cameras (J3.25), Interface (J6.39)
CSI4_D0_P: Cameras (J3.26), Interface (J6.37)
CSI4_D1_N: Cameras (J3.23), Interface (J6.49)
CSI4_D1_P: Cameras (J3.24), Interface (J6.47)
CSI5_CLK_N: Cameras (J3.10), Interface (J6.44)
CSI5_CLK_P: Cameras (J3.11), Interface (J6.42)
CSI5_D0_N: Cameras (J3.7), Interface (J6.40)
CSI5_D0_P: Cameras (J3.8), Interface (J6.38)
CSI5_D1_N: Cameras (J3.5), Interface (J6.50)
CSI5_D1_P: Cameras (J3.6), Interface (J6.48)
I2C_GP7_SCL_1V8: ID-Serial (IC14.14 IC15.6 R47.1), Interface (IC1.17)
I2C_GP7_SDA_1V8: ID-Serial (IC14.15 IC15.5 R42.1), Interface (IC1.16)
LED_G: CAN (Q1.2 R31.1), Interface (J6.66)
LED_R: CAN (Q1.5 R32.1), Interface (J6.70)
SPI_CS_3V3: CAN (IC2.16), Interface (IC5.13)
SPI_INT_3V3: CAN (IC2.12 R30.1), Interface (IC7.12)
SPI_MISO_3V3: CAN (IC2.15), Interface (IC5.11)
SPI_MOSI_3V3: CAN (IC2.14), Interface (IC5.12)
SPI_SCK_3V3: CAN (IC2.13), Interface (IC5.10)

## Assembly variants
Variant of TX1_Camera_Adapter: all parts fitted
Production: not fitted C8 C9 C10 C11 C12 C13 C14 C17 IC2 IC3 IC5 J4 R1 R8 R9 R10 R11 R12 R13 R14 R15 R20 R21 R22 R23 R26 R28 R29 R30 R48 R50 R52 R55 R57 R59 R61 R63 R65 R67 R68 R71 TERM Y1